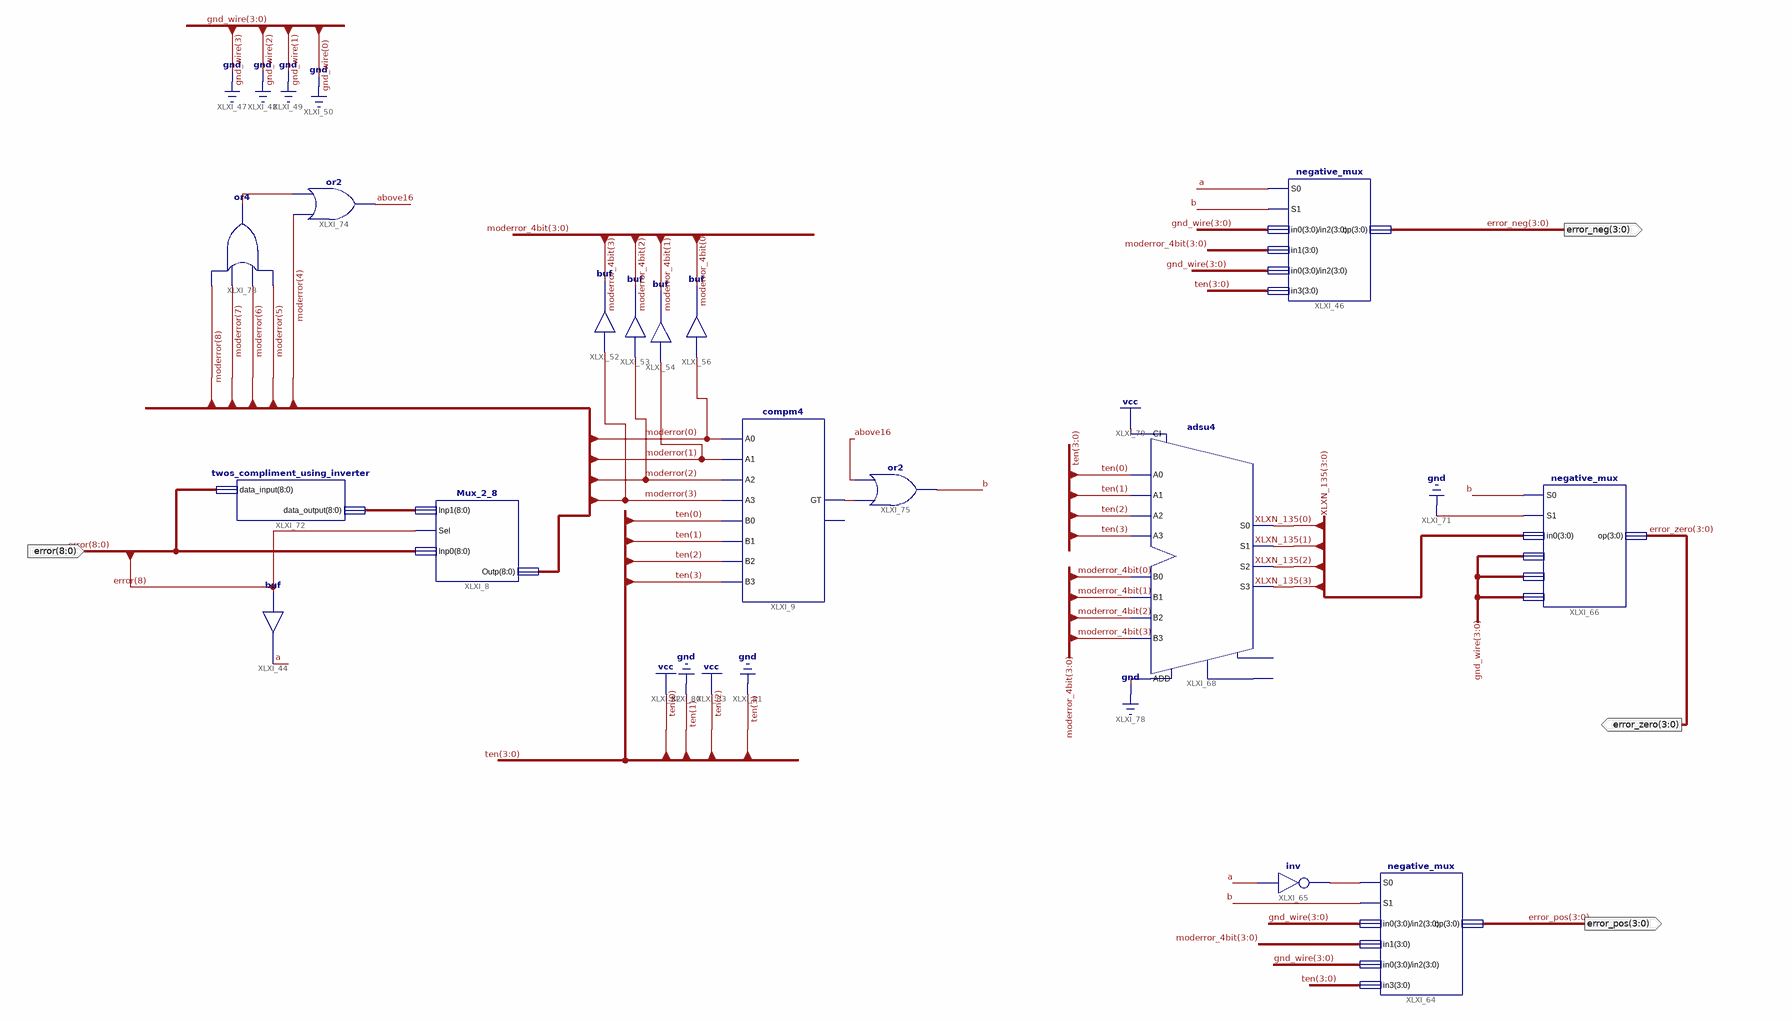
[diagram p0: schematic sheet 1]
// Xilinx ISE schematic error_derror_range_generator.sch (spartan3e) as structural Verilog: 16 symbols, 4 ports
module error_derror_range_generator (
  input  [8:0] error,
  output [3:0] error_neg,
  output [3:0] error_zero,
  output [3:0] error_pos
);

  wire a, above16, b, XLXN_107, XLXN_146, XLXN_148;
  wire [3:0] moderror_4bit, XLXN_135;
  wire [8:0] moderror, XLXN_136;

  Mux_2_8 XLXI_8 (.Inp1(XLXN_136), .Sel(error[8]), .Inp0(error), .Outp(moderror));
  compm4 XLXI_9 (
    .A0(moderror[0]), .A1(moderror[1]), .A2(moderror[2]), .A3(moderror[3]), .B0(1'b1), .B1(1'b0), .B2(1'b1),
    .B3(1'b0), .GT(XLXN_148));  // open: LT
  buf XLXI_44 (a, error[8]);
  negative_mux XLXI_46 (
    .S0(a), .S1(b), .in0(4'b0000), .in1(moderror_4bit), .in2(4'b0000), .in3(4'b0101), .op(error_neg));
  buf XLXI_52 (moderror_4bit[3], moderror[3]);
  buf XLXI_53 (moderror_4bit[2], moderror[2]);
  buf XLXI_54 (moderror_4bit[1], moderror[1]);
  buf XLXI_56 (moderror_4bit[0], moderror[0]);
  negative_mux XLXI_64 (
    .S0(XLXN_107), .S1(b), .in0(4'b0000), .in1(moderror_4bit), .in2(4'b0000), .in3(4'b0101), .op(error_pos));
  not XLXI_65 (XLXN_107, a);
  negative_mux XLXI_66 (
    .S0(b), .S1(1'b0), .in0(XLXN_135), .in1(4'b0000), .in2(4'b0000), .in3(4'b0000), .op(error_zero));
  adsu4 XLXI_68 (
    .A0(1'b1), .A1(1'b0), .A2(1'b1), .A3(1'b0), .ADD(1'b0), .B0(moderror_4bit[0]), .B1(moderror_4bit[1]),
    .B2(moderror_4bit[2]), .B3(moderror_4bit[3]), .CI(1'b1), .S0(XLXN_135[0]), .S1(XLXN_135[1]),
    .S2(XLXN_135[2]), .S3(XLXN_135[3]));  // open: CO, OFL
  twos_compliment_using_inverter XLXI_72 (.data_input(error), .data_output(XLXN_136));
  or XLXI_73 (XLXN_146, moderror[5], moderror[6], moderror[7], moderror[8]);
  or XLXI_74 (above16, moderror[4], XLXN_146);
  or XLXI_75 (b, XLXN_148, above16);
endmodule
